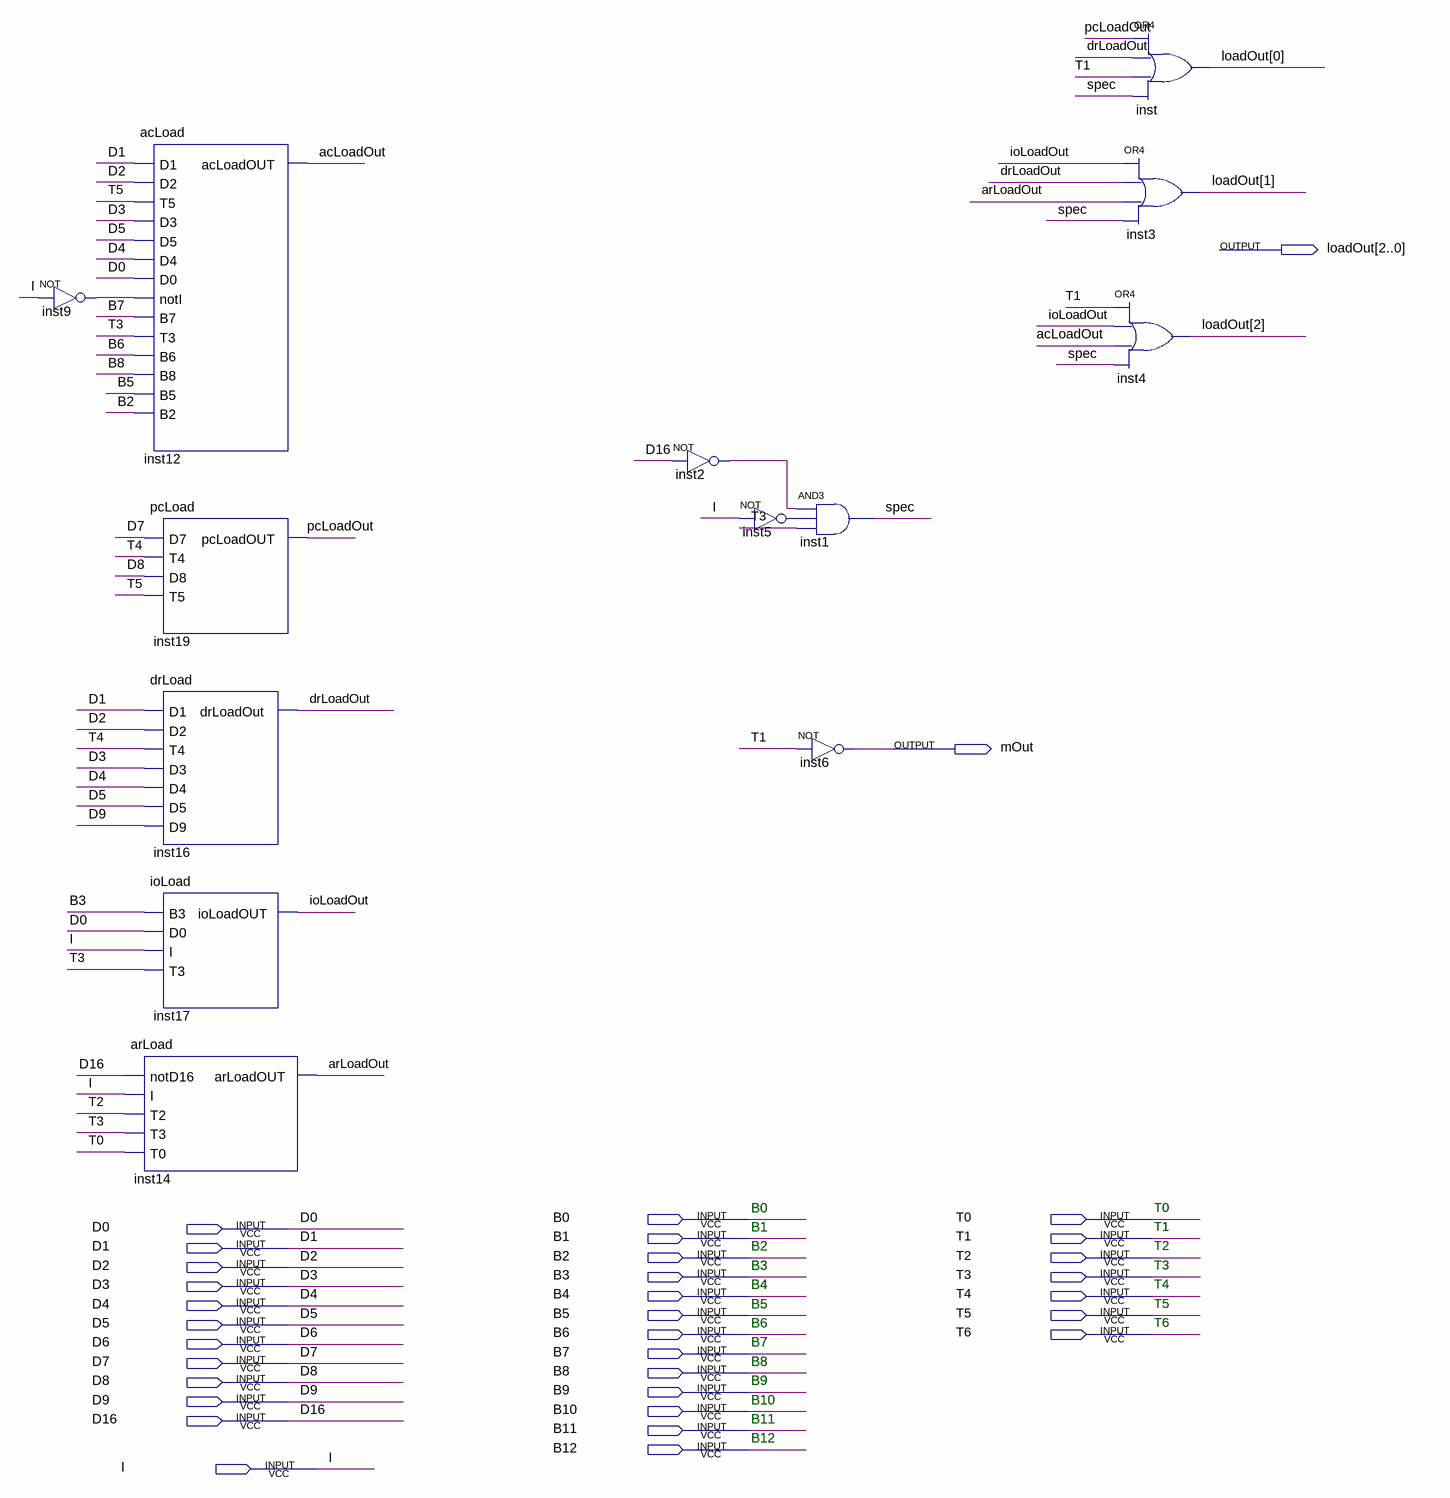
[diagram p0: schematic sheet]
// Quartus schematic loadEncode.bdf as structural Verilog: 13 symbols, 34 pins
module loadEncode (
  input  B0,
  input  T0,
  input  D0,
  input  B1,
  input  T1,
  input  D1,
  input  B2,
  input  T2,
  input  D2,
  input  B3,
  input  T3,
  input  D3,
  input  B4,
  input  T4,
  input  D4,
  input  B5,
  input  T5,
  input  D5,
  input  B6,
  input  T6,
  input  D6,
  input  B7,
  input  D7,
  input  B8,
  input  D8,
  input  B9,
  input  D9,
  input  B10,
  input  D16,
  input  B11,
  input  B12,
  input  I,
  output [2:0] loadOut,
  output mOut
);

  wire acLoadOut, arLoadOut, drLoadOut, inst2_out, inst5_out, inst9_out, ioLoadOut, pcLoadOut, spec;

  not inst9 (inst9_out, I);
  arLoad inst14 (.notD16(D16), .I(I), .T2(T2), .T3(T3), .T0(T0), .arLoadOUT(arLoadOut));
  acLoad inst12 (
    .D1(D1), .D2(D2), .T5(T5), .D3(D3), .D5(D5), .D4(D4), .D0(D0), .notI(inst9_out), .B7(B7), .T3(T3),
    .B6(B6), .B8(B8), .B5(B5), .B2(B2), .acLoadOUT(acLoadOut));
  pcLoad inst19 (.D7(D7), .T4(T4), .D8(D8), .T5(T5), .pcLoadOUT(pcLoadOut));
  drLoad inst16 (.D1(D1), .D2(D2), .T4(T4), .D3(D3), .D4(D4), .D5(D5), .D9(D9), .drLoadOut(drLoadOut));
  ioLoad inst17 (.B3(B3), .D0(D0), .I(I), .T3(T3), .ioLoadOUT(ioLoadOut));
  not inst2 (inst2_out, D16);
  not inst5 (inst5_out, I);
  and inst1 (spec, inst2_out, inst5_out, T3);
  not inst6 (mOut, T1);
  or inst3 (loadOut[1], ioLoadOut, drLoadOut, arLoadOut, spec);
  or inst4 (loadOut[2], T1, ioLoadOut, acLoadOut, spec);
  or inst (loadOut[0], pcLoadOut, drLoadOut, T1, spec);

  // Notes on the sheet:
  //   B0
  //   T0
  //   B1
  //   T1
  //   B2
  //   T2
  //   B3
  //   T3
  //   B4
  //   T4
  //   B5
  //   T5
  //   B6
  //   T6
  //   B7
  //   B8
  //   B9
  //   B10
  //   B11
  //   B12
endmodule
